# Altium project ĐATN_Project.PrjPcb
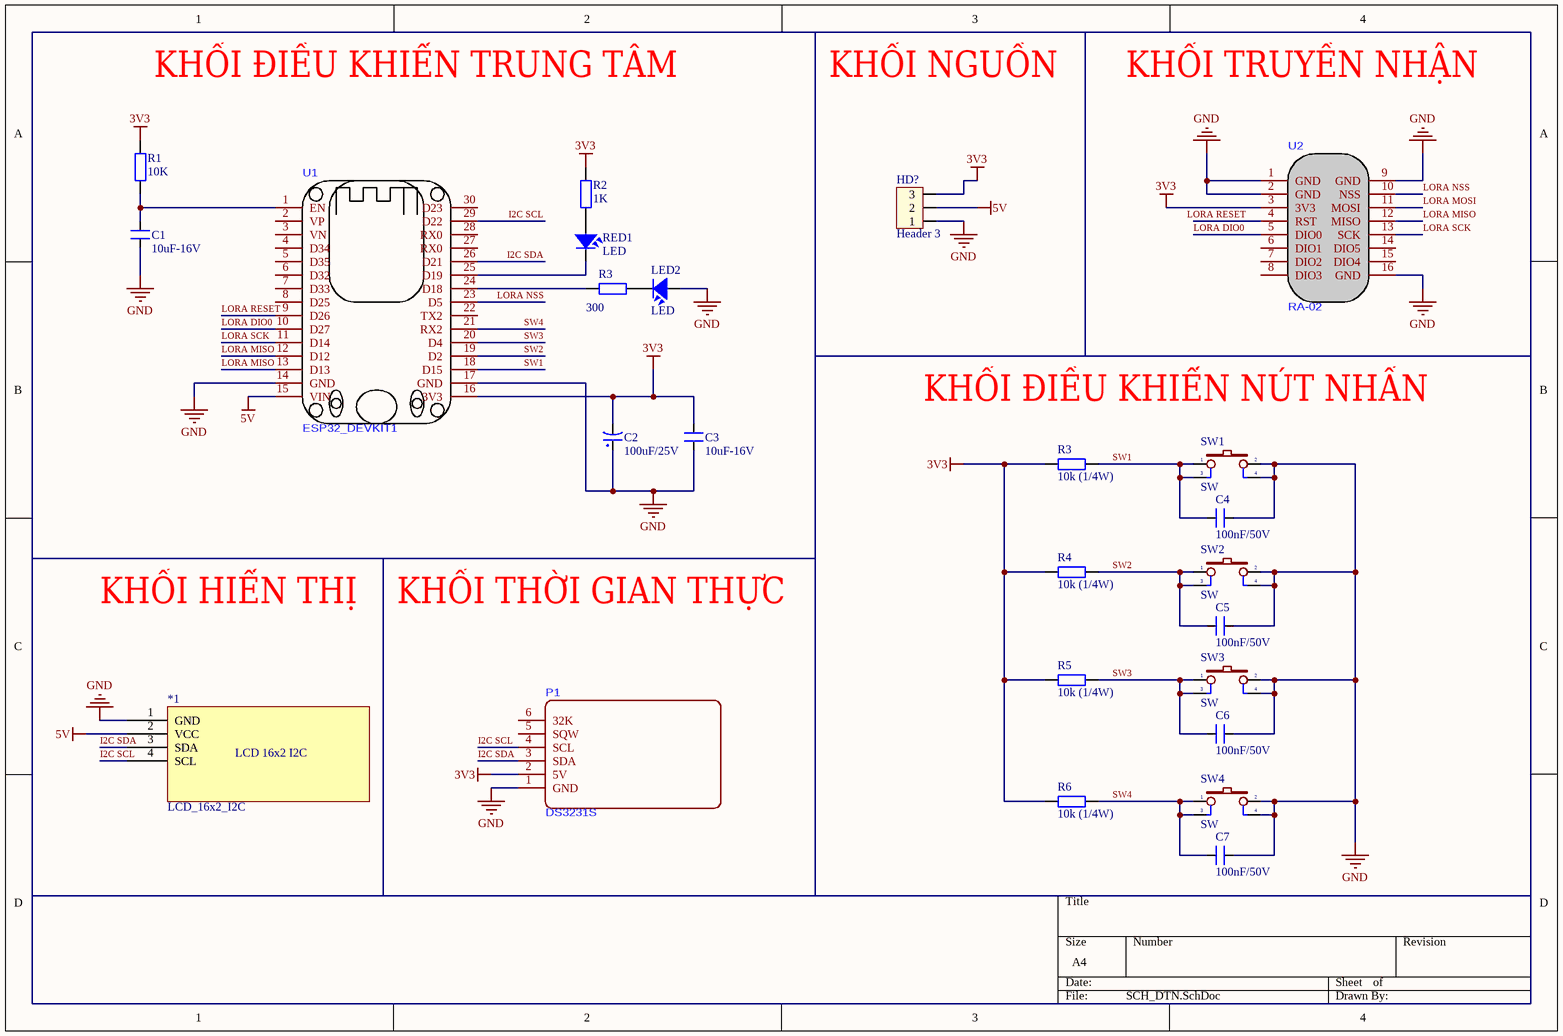
[diagram p0: SCH_DTN.SchDoc]
1 sheet, 25 parts. Net scope: global (net labels, ports and power ports of the same name join across sheets).
Board file: PCB_DTN.PcbDoc

## Sheet SCH_DTN.SchDoc
size A4; SheetNumber: 1; SheetTotal: 1

### Parts
(Parts that share a designator on the sheet are numbered #1, #2 ... from top to bottom, then left to right.)
*1  LCD_16x2_I2C  [LCD_16x2_I2C]
C1  10uF-16V  [SM-0805]
C2  100uF/25V  [CP1.5/3.4]
C3  10uF-16V  [SM-0805]
C4  100nF/50V  [CN1.5]
C5  100nF/50V  [CN1.5]
C6  100nF/50V  [CN1.5]
C7  100nF/50V  [CN1.5]
HD?  Header 3  [HED3T]
LED2  LED  [LED-5 GRe]
P1  DS3231S  [DS3231S - duplicate]
R1  10K  [SM-0805]
R2  1K  [SM-0805]
R3#1  300  [R1/4W]
R3#2  10k (1/4W)  [R1/4W]
R4  10k (1/4W)  [R1/4W]
R5  10k (1/4W)  [R1/4W]
R6  10k (1/4W)  [R1/4W]
RED1  LED  [LED-5TRED]
SW1  SW  [SW4]
SW2  SW  [SW4]
SW3  SW  [SW4]
SW4  SW  [SW4]
U1  ESP32_DEVKIT1  [ESP32_DEVKIT1]
U2  RA-02  [LORA RA 02]

### Nets
3V3: C2.2 C3.2 HD?.3 P1.2(5V) R1.2 R2.2 R3#2.1 R4.1 R5.1 R6.1 U1.16(3V3) U2.3(3V3)
5V: *1.2(VCC) HD?.2 U1.15(VIN)
GND: *1.1(GND) C1.1 C2.1 C3.1 C4.2 C5.2 C6.2 C7.2 HD?.1 LED2.1 P1.1(GND) SW1.2 SW1.4 SW2.2 SW2.4 SW3.2 SW3.4 SW4.2 SW4.4 U1.14(GND) U1.17(GND) U2.1(GND) U2.2(GND) U2.9(GND) U2.16(GND)
I2C SCL: *1.4(SCL) P1.4(SCL) U1.29(D22)
I2C SDA: *1.3(SDA) P1.3(SDA) U1.26(D21)
LORA DIO0: U1.10(D27) U2.5(DIO0)
LORA MISO: U1.12(D12) U1.13(D13) U2.12(MISO)
LORA MOSI: U2.11(MOSI)
LORA NSS: U1.23(D5) U2.10(NSS)
LORA RESET: U1.9(D26) U2.4(RST)
LORA SCK: U1.11(D14) U2.13(SCK)
SW1: C4.1 R3#2.2 SW1.1 SW1.3 U1.18(D15)
SW2: C5.1 R4.2 SW2.1 SW2.3 U1.19(D2)
SW3: C6.1 R5.2 SW3.1 SW3.3 U1.20(D4)
SW4: C7.1 R6.2 SW4.1 SW4.3 U1.21(RX2)
NetC1_2: C1.2 R1.1 U1.1(EN)
NetLED2_2: LED2.2 R3#1.2
NetR2_1: R2.1 RED1.1
NetR3#1_1: R3#1.1 U1.24(D18)
NetRED1_2: RED1.2 U1.25(D19)

Not connected (* = marked no-connect by the designer): P1 5(SQW) 6(32K); U1 2(VP) 3(VN) 4(D34) 5(D35) 6(D32) 7(D33) 8(D25) 22(TX2) 27(RX0) 28(RX0) 30(D23); U2 6(DIO1) 7(DIO2) 8(DIO3) 14(DIO5) 15(DIO4)

### Notes on the sheet
- KHỐI ĐIỀU KHIỂN TRUNG TÂM
- KHỐI NGUỒN
- KHỐI TRUYỀN NHẬN
- KHỐI ĐIỀU KHIỂN NÚT NHẤN
- KHỐI HIỂN THỊ
- KHỐI THỜI GIAN THỰC
- (in symbol LCD_16x2_I2C) LCD 16x2 I2C

### Library data of the parts
C1 C3 = CM: Cap SMD; Value: 103
C2 = CP3: Cap 100uF/35V - 470uF/16V; Value: 100uF/35V/50V; Description 1: 1000uF/6,3V - 470uF/16V - 330uF - 25V; Description 2: 220uF/35V - 100uF/50V - 63V - 4,7uF/200V; Description 3: 22uF => 33uF100V - 3,3uF => 4,7uF/250V; Description 4: 2,2uF =>3,3uF/350 - 2,2uF/400V - 1uF/450V
C4-C7 = CN1.5: Cap np 682pF => 104pF; Value: 0.01uF
HD? = Hed3: Header 3 (Green); Value: Header 3
LED2 RED1 = LED: LED Single colour Green and Red; Value: LED 3 ly Single Colour
R1 = RM: Resistor SMD; Value: 1K
R2 = RM: Resistor SMD; Value: 1K
R3#1 R3#2 R4-R6 = R1/4W: Resistor 1/4W; Value: R1/4W - 1K
SW1-SW4 = SW4-1: Switch button 4 pin; Value: SW chip 4 pin